# Altium schematic sheet [MP] LoRa.SchDoc
size 254 x 208 mm; SheetNumber: 4; SheetTotal: 8
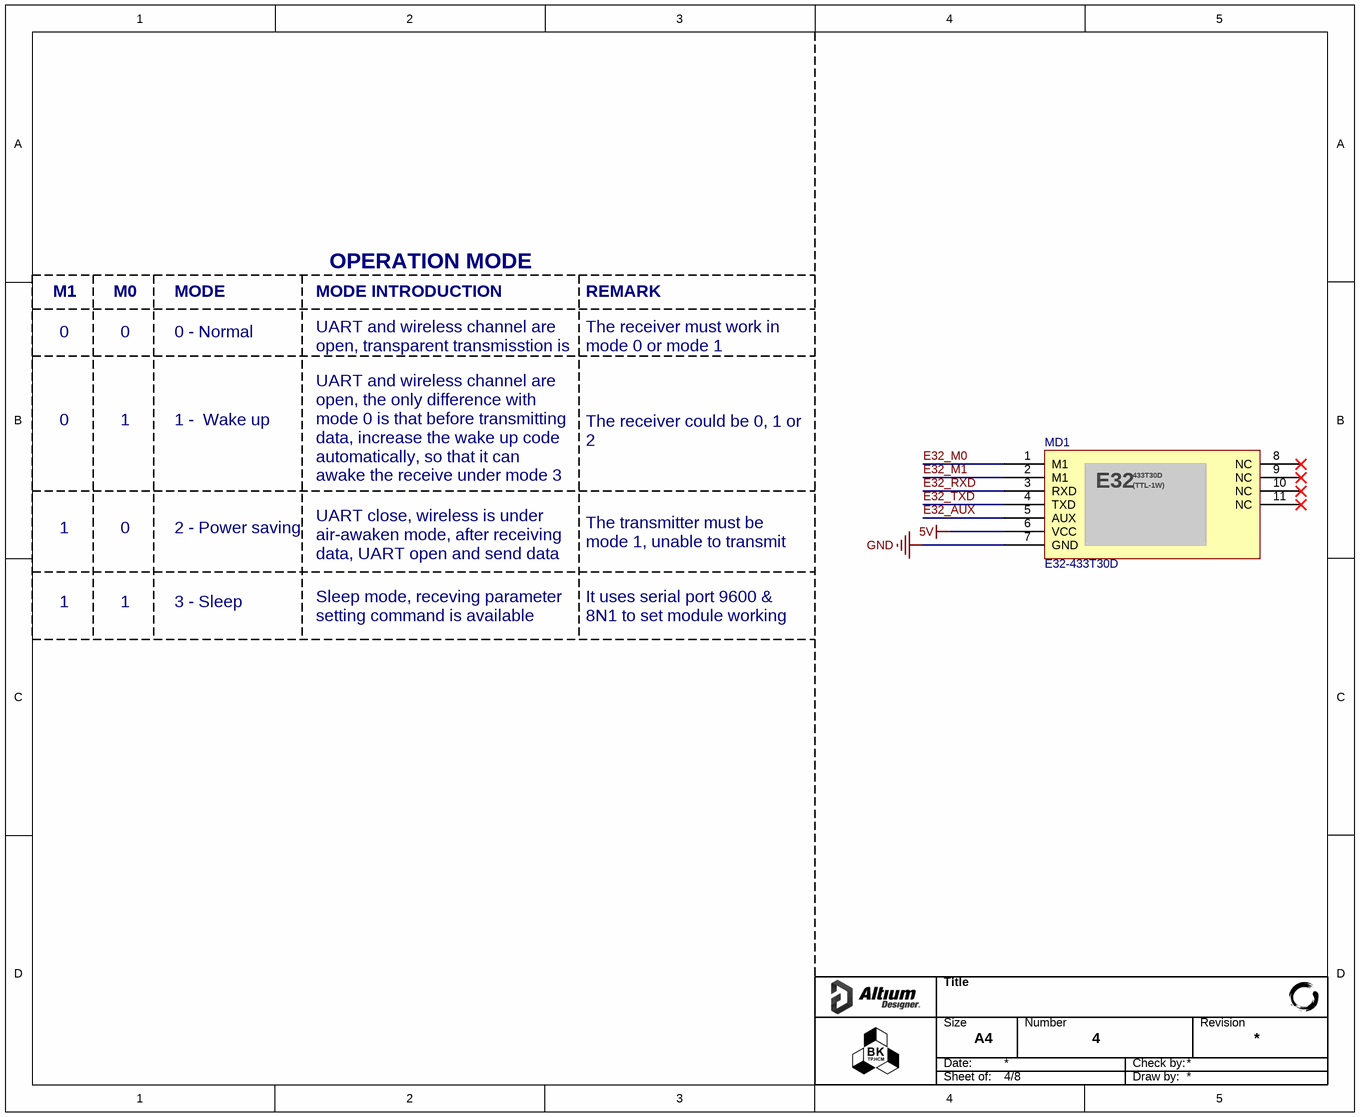
[diagram p0: [MP] LoRa.SchDoc]

## Parts
MD1  E32-433T30D  [E32-433T30D]

## Nets
5V: MD1.6(VCC)
GND: MD1.7(GND)
E32_AUX: MD1.5(AUX)
E32_M0: MD1.1(M1)
E32_M1: MD1.2(M1)
E32_RXD: MD1.3(RXD)
E32_TXD: MD1.4(TXD)

Not connected (* = marked no-connect by the designer): MD1 8(NC)* 9(NC)* 10(NC)* 11(NC)*

## Notes on the sheet
- M1
- M0
- MODE
- MODE INTRODUCTION
- OPERATION MODE
- REMARK
- 0
- 0 - Normal
- UART and wireless channel are open, transparent transmisstion is on
- The receiver must work in mode 0 or mode 1
- 1
- 1 -  Wake up
- The receiver could be 0, 1 or 2
- UART and wireless channel are open, the only difference with mode 0 is that before transmitting data, increase the wake up code automatically, so that it can awake the receive under mode 3
- 2 - Power saving
- The transmitter must be mode 1, unable to transmit in this mode
- 3 - Sleep
- UART close, wireless is under air-awaken mode, after receiving data, UART open and send data
- It uses serial port 9600 & 8N1 to set module working parameters
- Sleep mode, receving parameter setting command is available
- Title
- Size
- Date:
- A4
- Number
- Check by:
- Revision
- Sheet of:
- Draw by:
- (in symbol CMP-021-00011-2) 433T30D; E32; (TTL-1W)

## Library data of the parts
MD1 = CMP-021-00011-2